# Altium schematic sheet A题功率.SchDoc
size A1
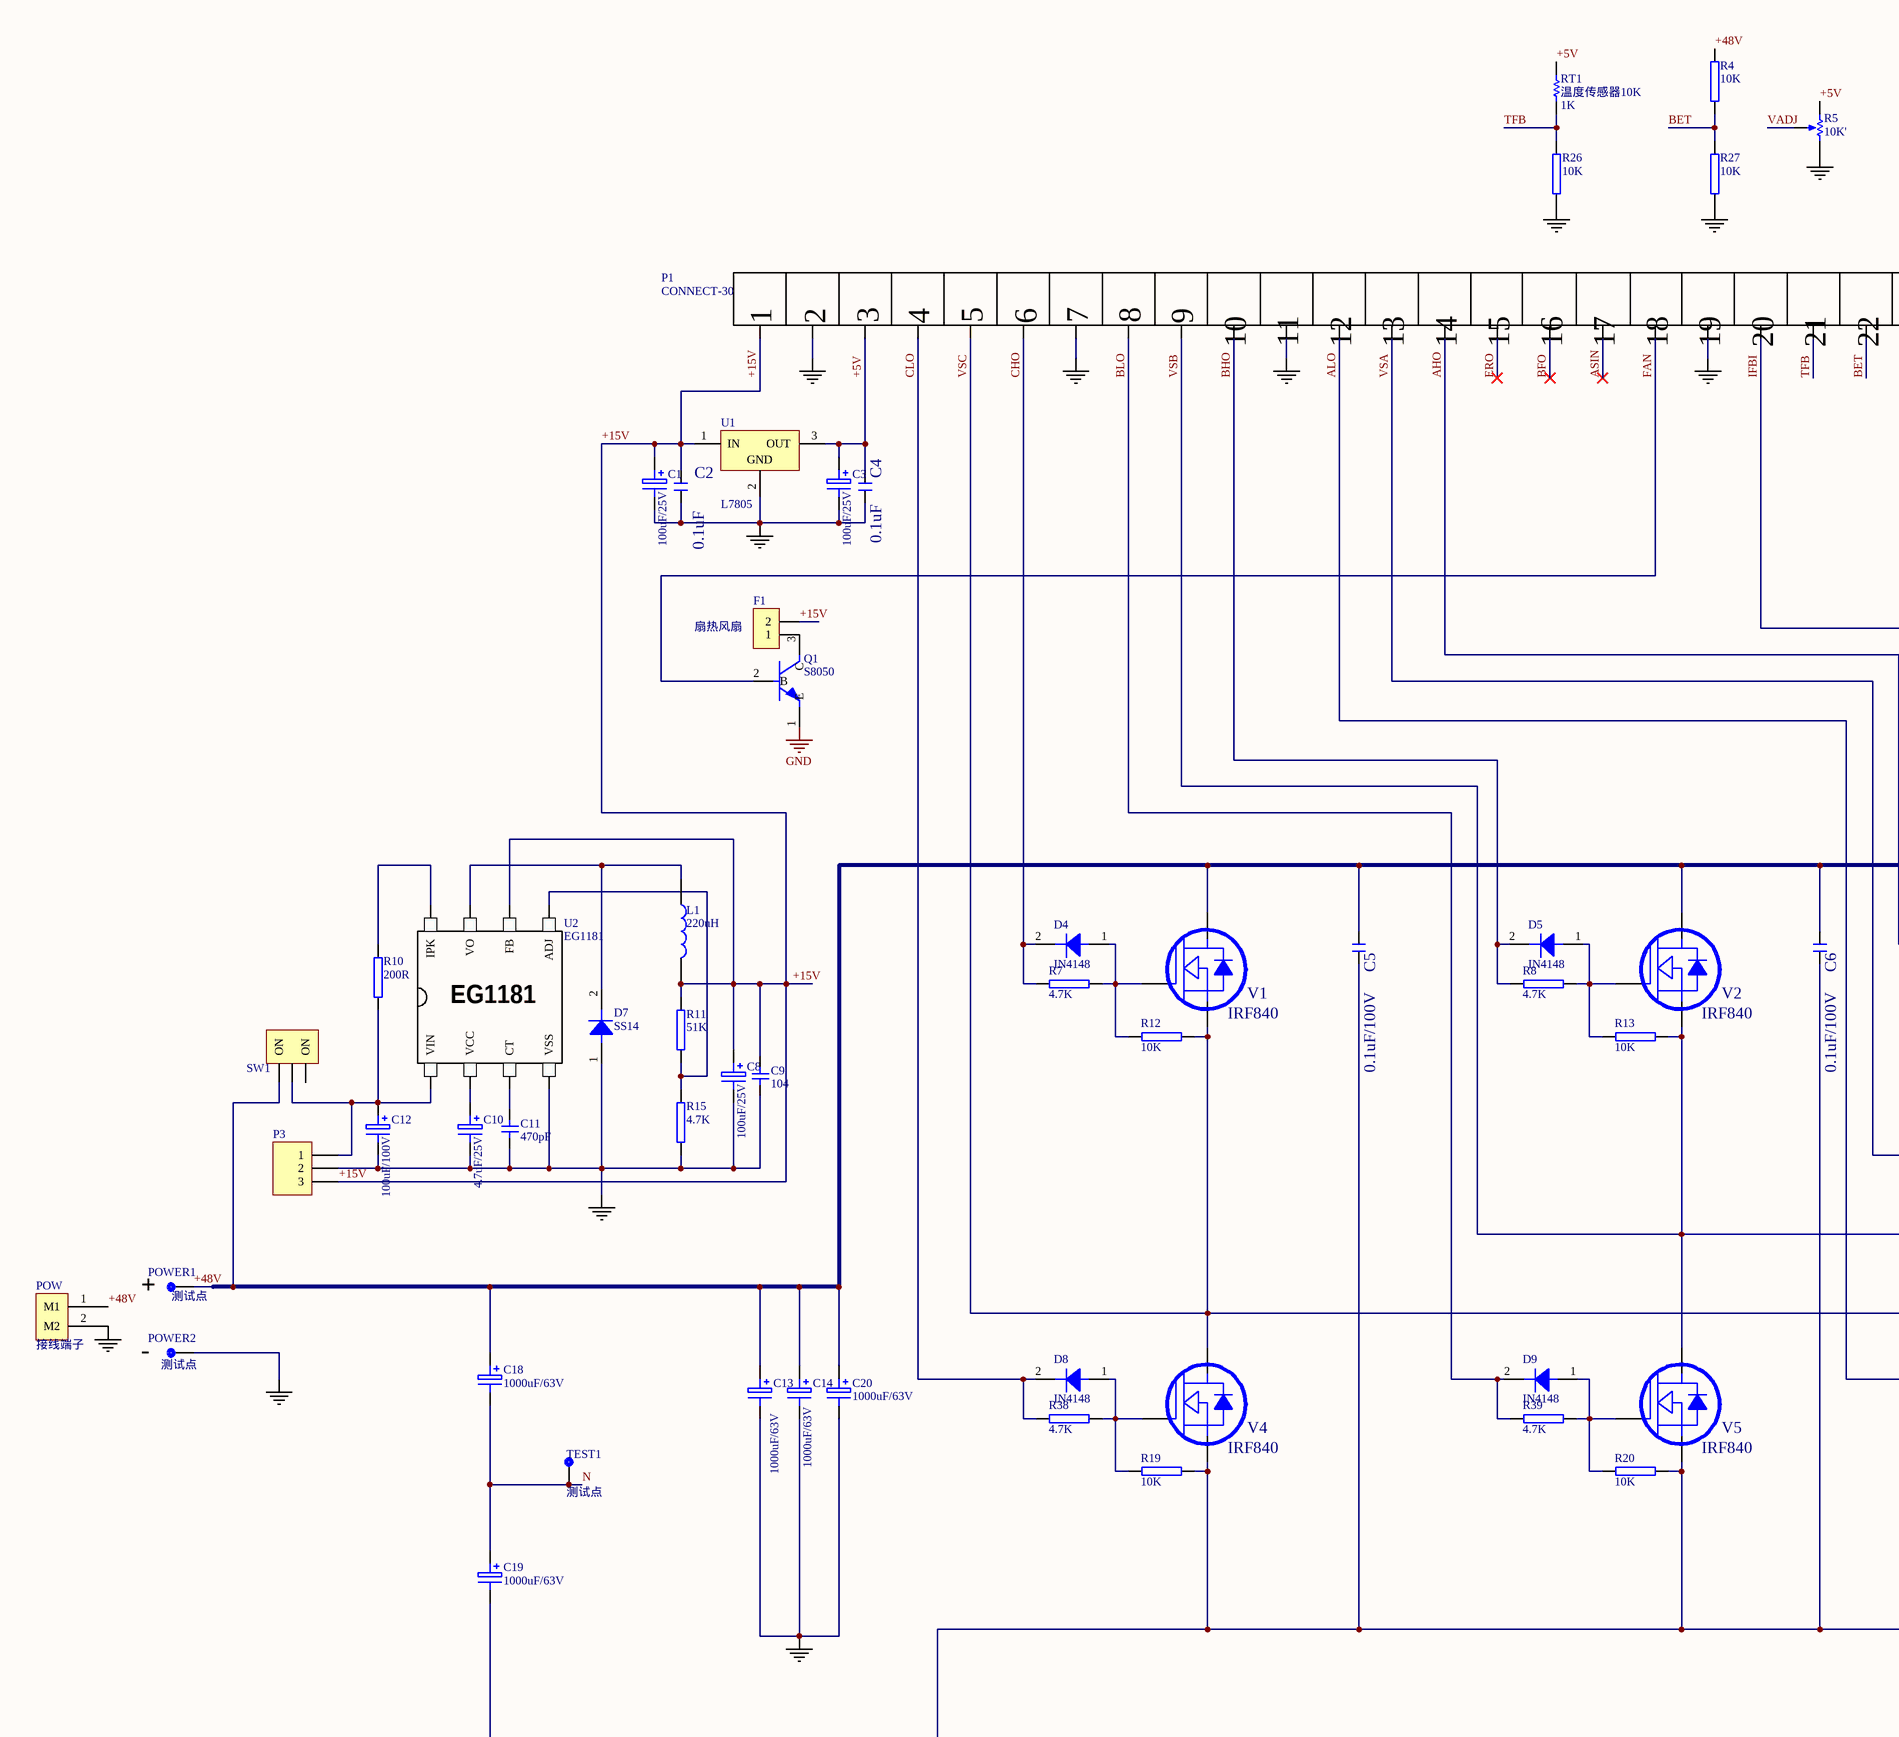
[diagram p0: A题功率.SchDoc, left]
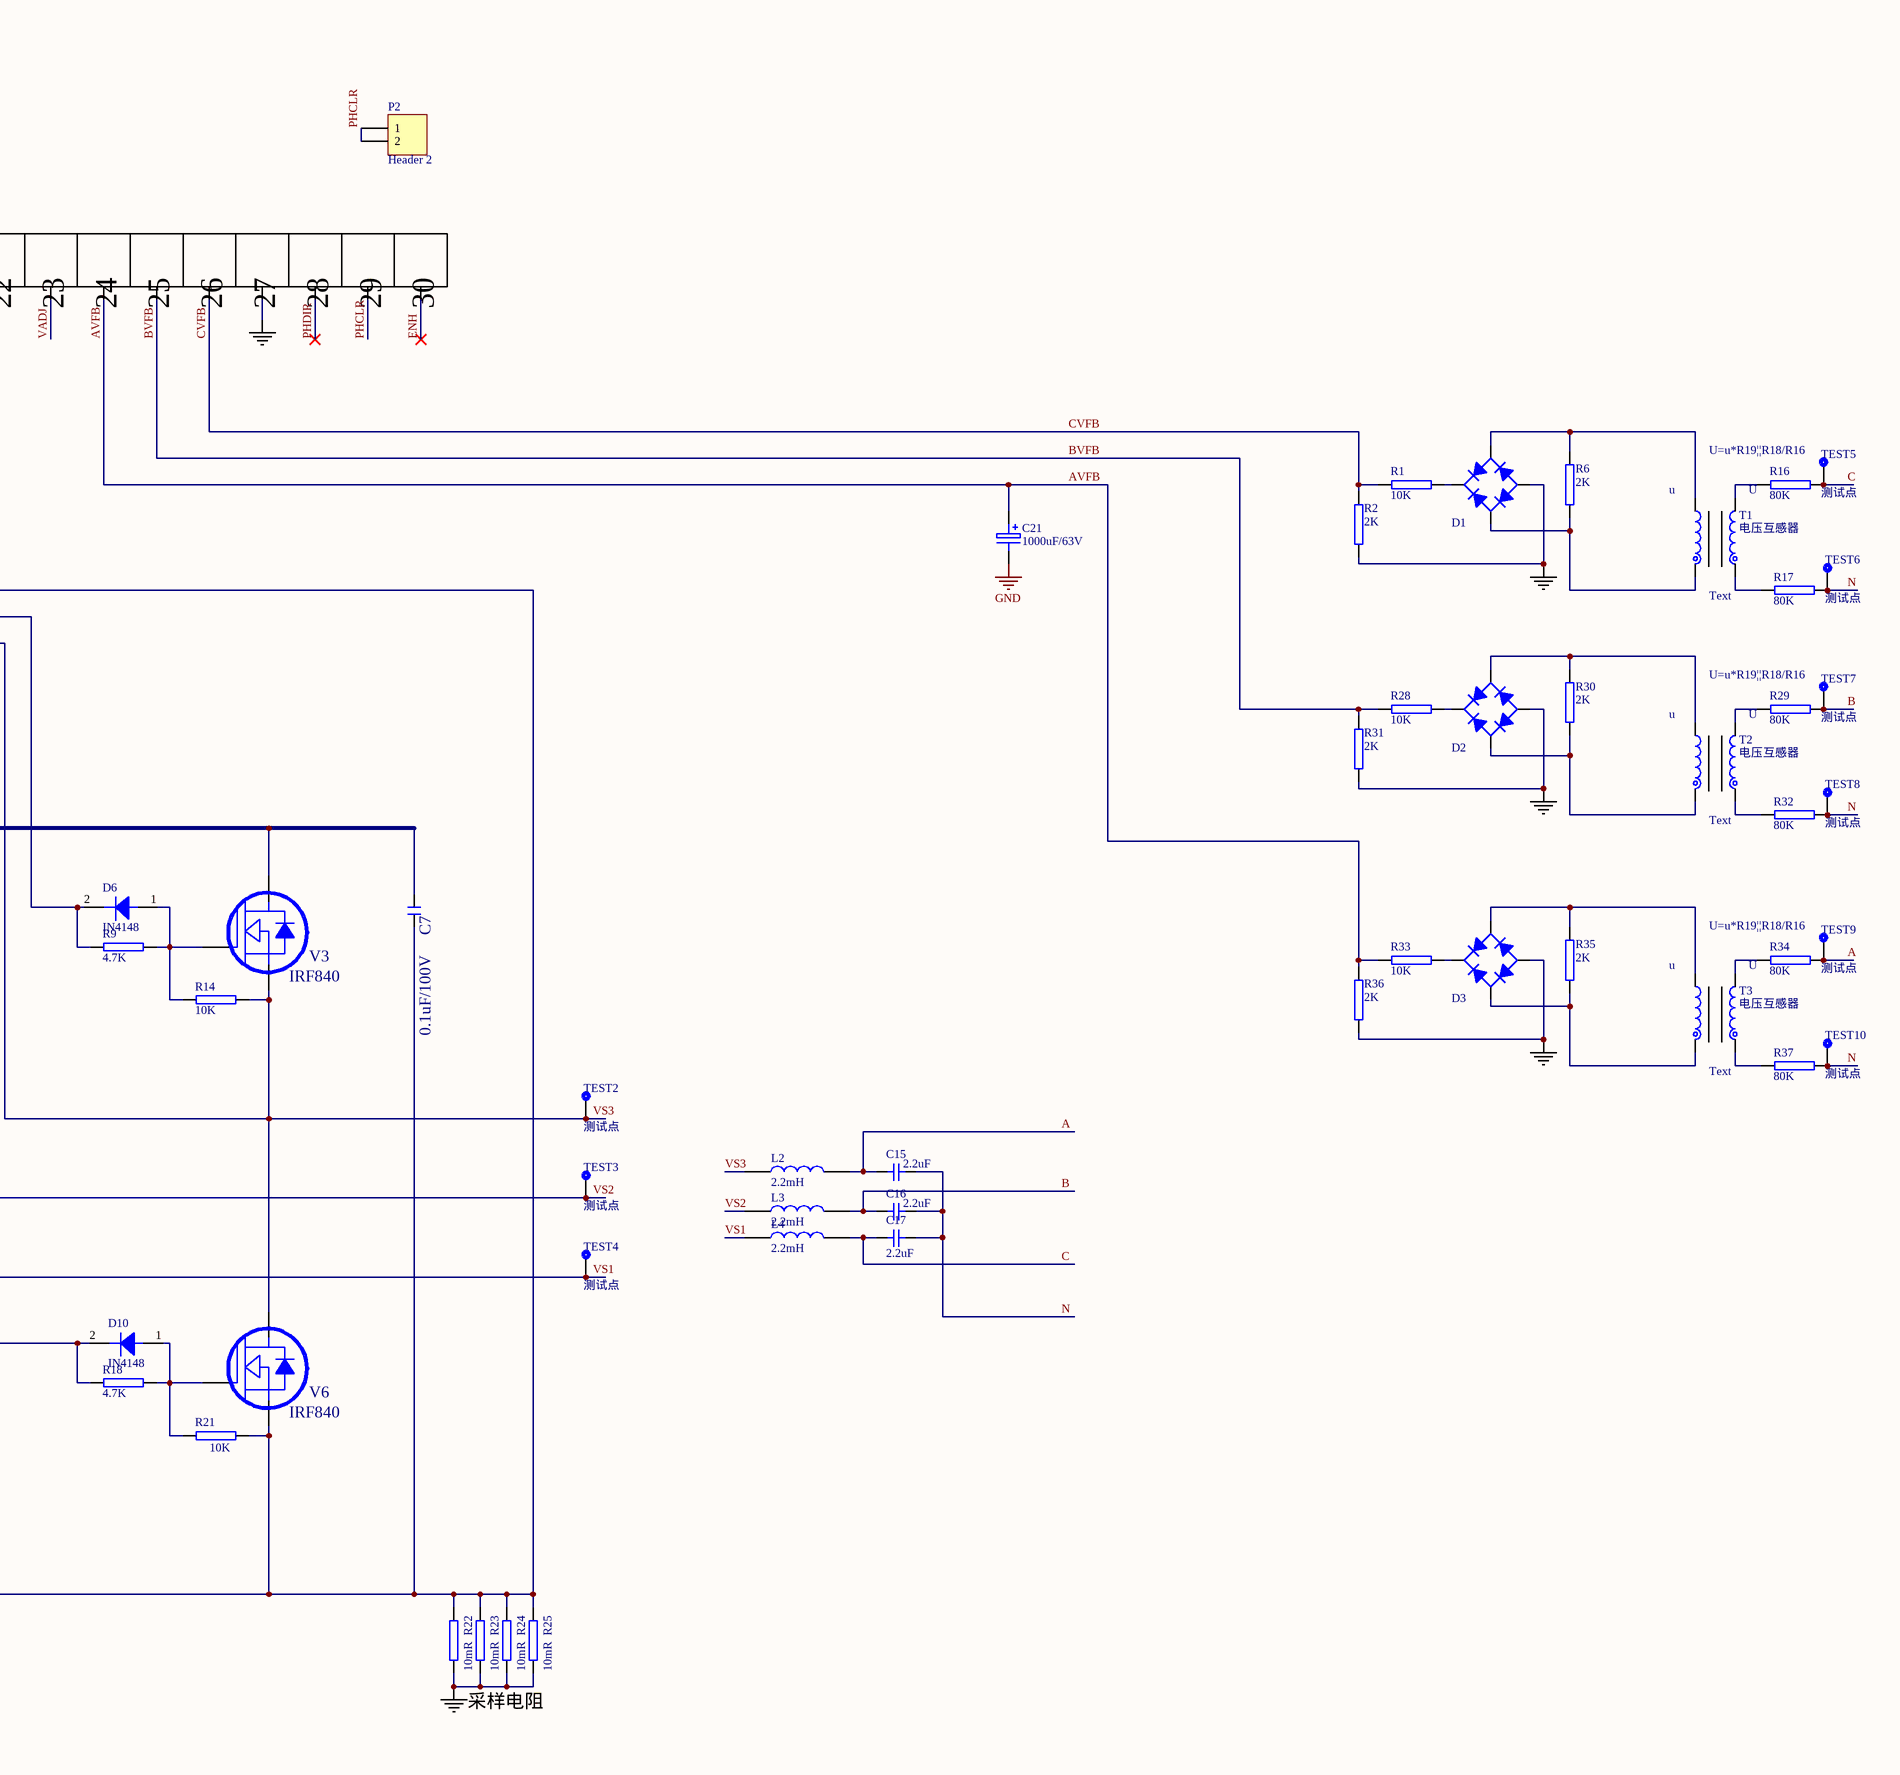
[diagram p1: A题功率.SchDoc, right]

## Parts
C1  100uF/25V  [Cap(直插)RB.8]
C2  0.1uF  [0805]
C3  100uF/25V  [Cap(直插)RB.8]
C4  0.1uF  [0805]
C5  0.1uF/100V  [AXIAL-0.6]
C6  0.1uF/100V  [AXIAL-0.6]
C7  0.1uF/100V  [AXIAL-0.6]
C8  100uF/25V  [Cap(直插)RB.8]
C9  104  [0805C]
C10  4.7uF/25V  [Cap(直插)RB.8]
C11  470pF  [0805C]
C12  100uF/100V  [Cap(直插)RB.8]
C13  1000uF/63V  [Cap-RB.16(直插)]
C14  1000uF/63V  [Cap-RB.16(直插)]
C15  2.2uF  [涤纶大电容]
C16  2.2uF  [涤纶大电容]
C17  2.2uF  [涤纶大电容]
C18  1000uF/63V  [Cap-RB.16(直插)]
C19  1000uF/63V  [Cap-RB.16(直插)]
C20  1000uF/63V  [Cap-RB.16(直插)]
C21  1000uF/63V  [Cap-RB.16(直插)]
D1  Bridge1  [D-38]  (value not drawn)
D2  Bridge1  [D-38]  (value not drawn)
D3  Bridge1  [D-38]  (value not drawn)
D4  IN4148  [D1(直插)]
D5  IN4148  [D1(直插)]
D6  IN4148  [D1(直插)]
D7  SS14  [SS14]
D8  IN4148  [D1(直插)]
D9  IN4148  [D1(直插)]
D10  IN4148  [D1(直插)]
F1  扇热风扇  [Header 2]
L1  220uH  [电感 220uH(大)]
L2  2.2mH  [大电感]
L3  2.2mH  [大电感]
L4  2.2mH  [大电感]
P1  CONNECT-30  [HDR1X30]
P2  Header 2  [HDR1X2]
P3  Header 3  [HDR1X3]  (value not drawn)
POW  接线端子  [接线端子-2P-5.0MM]
POWER1  测试点  [测试点]
POWER2  测试点  [测试点]
Q1  S8050  [NPN]
R1  10K  [0805R]
R2  2K  [0805R]
R4  10K  [0805R]
R5  10K'  [顶调电位器]
R6  2K  [0805R]
R7  4.7K  [0805R]
R8  4.7K  [0805R]
R9  4.7K  [0805R]
R10  200R  [0805R]
R11  51K  [0805R]
R12  10K  [0805R]
R13  10K  [0805R]
R14  10K  [0805R]
R15  4.7K  [0805R]
R16  80K  [0805R]
R17  80K  [0805R]
R18  4.7K  [0805R]
R19  10K  [0805R]
R20  10K  [0805R]
R21  10K  [0805R]
R22  10mR  [1210R]
R23  10mR  [1210R]
R24  10mR  [1210R]
R25  10mR  [1210R]
R26  10K  [0805R]
R27  10K  [0805R]
R28  10K  [0805R]
R29  80K  [0805R]
R30  2K  [0805R]
R31  2K  [0805R]
R32  80K  [0805R]
R33  10K  [0805R]
R34  80K  [0805R]
R35  2K  [0805R]
R36  2K  [0805R]
R37  80K  [0805R]
R38  4.7K  [0805R]
R39  4.7K  [0805R]
RT1  温度传感器10K  value 1K  [AXIAL-0.3]
SW1  KEY  [钮子开关（大）]  (value not drawn)
T1  电压互感器  [电压互感器]
T2  电压互感器  [电压互感器]
T3  电压互感器  [电压互感器]
TEST1  测试点  [测试点]
TEST2  测试点  [测试点]
TEST3  测试点  [测试点]
TEST4  测试点  [测试点]
TEST5  测试点  [测试点]
TEST6  测试点  [测试点]
TEST7  测试点  [测试点]
TEST8  测试点  [测试点]
TEST9  测试点  [测试点]
TEST10  测试点  [测试点]
U1  L7805  [T03B]
U2  EG1181  [EG1181]
V1  IRF840  [T03B]
V2  IRF840  [T03B]
V3  IRF840  [T03B]
V4  IRF840  [T03B]
V5  IRF840  [T03B]
V6  IRF840  [T03B]

## Nets
GND: C1.2 C2.1 C3.2 C4.1 C8.2 C9.1 C10.2 C11.1 C12.2 C13.2 C14.2 C20.2 C21.2 D1.3(V-) D2.3(V-) D3.3(V-) D7.1 P1.2 P1.7 P1.11 P1.19 P1.27 P3.2 POW.2(M2) POWER2.1 Q1.1(E) R2.1 R5.1(BOT) R15.1 R22.1 R23.1 R24.1 R25.1 R26.1 R27.1 R31.1 R36.1 U1.2(GND) U2.4(VSS)
+5V: C3.1 C4.2 P1.3 R5.3(TOP) RT1.2 U1.3(OUT)
+15V: C1.1 C2.2 C8.1 C9.2 F1.2 L1.2 P1.1 P3.3 R11.2 U1.1(IN) U2.6(FB)
+48V: C5.1 C6.1 C7.1 C13.1 C14.1 C18.1 C20.1 POW.1(M1) POWER1.1 R4.2 SW1.1(ON) V1.2(D) V2.2(D) V3.2(D)
A: C15.1 L2.2 R34.2 TEST9.1
AHO: D6.2 P1.14 R9.1
ALO: D10.2 P1.12 R18.1
ASIN: P1.17
AVFB: C21.1 P1.24 R33.1 R36.2
B: C16.1 L3.2 R29.2 TEST7.1
BET: P1.22 R4.1 R27.2
BFO: P1.16
BHO: D5.2 P1.10 R8.1
BLO: D9.2 P1.8 R39.1
BVFB: P1.25 R28.1 R31.2
C: C17.1 L4.2 R16.2 TEST5.1
CHO: D4.2 P1.6 R7.1
CLO: D8.2 P1.4 R38.1
CVFB: P1.26 R1.1 R2.2
ENH: P1.30
ERO: P1.15
FAN: P1.18 Q1.2(B)
IFBI: C5.2 C6.2 C7.2 C19.2 P1.20 R19.2 R20.2 R21.2 R22.2 R23.2 R24.2 R25.2 V4.3(S) V5.3(S) V6.3(S)
N: C15.2 C16.2 C17.2 C18.2 C19.1 R17.2 R32.2 R37.2 TEST1.1 TEST6.1 TEST8.1 TEST10.1
PHCLR: P1.29 P2.1 P2.2
PHDIR: P1.28
TFB: P1.21 R26.2 RT1.1
VADJ: P1.23 R5.2(TAP)
VS1: L4.1 P1.5 R12.2 TEST4.1 V1.3(S) V4.2(D)  [also labelled VSC]
VS2: L3.1 P1.9 R13.2 TEST3.1 V2.3(S) V5.2(D)  [also labelled VSB]
VS3: L2.1 P1.13 R14.2 TEST2.1 V3.3(S) V6.2(D)  [also labelled VSA]
NetC10_1: C10.1 U2.2(VCC)
NetC11_2: C11.2 U2.3(CT)
NetC12_1: C12.1 P3.1 R10.1 SW1.2(com) U2.1(VIN)
NetD1_1: D1.1(V+) R1.2
NetD1_2: D1.2(AC) R6.1 T1.1
NetD1_4: D1.4(AC) R6.2 T1.2
NetD2_1: D2.1(V+) R28.2
NetD2_2: D2.2(AC) R30.1 T2.1
NetD2_4: D2.4(AC) R30.2 T2.2
NetD3_1: D3.1(V+) R33.2
NetD3_2: D3.2(AC) R35.1 T3.1
NetD3_4: D3.4(AC) R35.2 T3.2
NetD4_1: D4.1 R7.2 R12.1 V1.1(G)
NetD5_1: D5.1 R8.2 R13.1 V2.1(G)
NetD6_1: D6.1 R9.2 R14.1 V3.1(G)
NetD7_2: D7.2 L1.1 U2.7(VO)
NetD8_1: D8.1 R19.1 R38.2 V4.1(G)
NetD9_1: D9.1 R20.1 R39.2 V5.1(G)
NetD10_1: D10.1 R18.2 R21.1 V6.1(G)
NetF1_1: F1.1 Q1.3(C)
NetR10_2: R10.2 U2.8(IPK)
NetR11_1: R11.1 R15.2 U2.5(ADJ)
NetR16_1: R16.1 T1.4
NetR17_1: R17.1 T1.3
NetR29_1: R29.1 T2.4
NetR32_1: R32.1 T2.3
NetR34_1: R34.1 T3.4
NetR37_1: R37.1 T3.3

Not connected (* = marked no-connect by the designer): SW1 3(ON)

## Notes on the sheet
- (near T1) u
- U=u*R19||R18/R16
- U
- Text
- (near T2) u
- (near T3) u
- (near POWER1) +
- (near POWER2) -
- 采样电阻

## Library data of the parts
C1 C3 C8 C10 C12-C14 C18-C21 = Cap1
C2 C4-C7 = CAP: Capacitor
C9 C11 C15-C17 = C1
D1-D3 = Bridge1: Full Wave Diode Bridge; Published: 8-Jun-2000; LatestRevisionDate: 17-Jul-2002; LatestRevisionNote: Re-released for DXP Platform.; PackageReference: D-38; Publisher: Altium Limited
D4-D6 D8-D10 = SS14
F1 = Header 2
L1-L4 = L1
P2 = Header 2: Header, 2-Pin; LatestRevisionDate: 17-Jul-2002; LatestRevisionNote: Re-released for DXP Platform.; Publisher: Altium Limited
P3 = Header 3: Header, 3-Pin; LatestRevisionDate: 17-Jul-2002; LatestRevisionNote: Re-released for DXP Platform.; Publisher: Altium Limited
POW = 接线端子(小)-2PIN
Q1 = Q2
R1 R2 R4 R6-R39 = R1
R5 = RPot: 可调电阻
RT1 = Res1: Resistor; Published: 8-Jun-2000; LatestRevisionDate: 17-Jul-2002; LatestRevisionNote: Re-released for DXP Platform.; PackageReference: AXIAL-0.3; Publisher: Altium Limited; PackageDescription: Axial Device, Thru-Hole; 2 Leads; 0.3 in Pin Spacing
SW1 = 钮子开关（大）: AC 250V/6A
T1-T3 = VTran
V1-V6 = 7575